# Altium schematic sheet CONNECTOR.SchDoc
size 420 x 297 mm; SheetNumber: 5; SheetTotal: 5
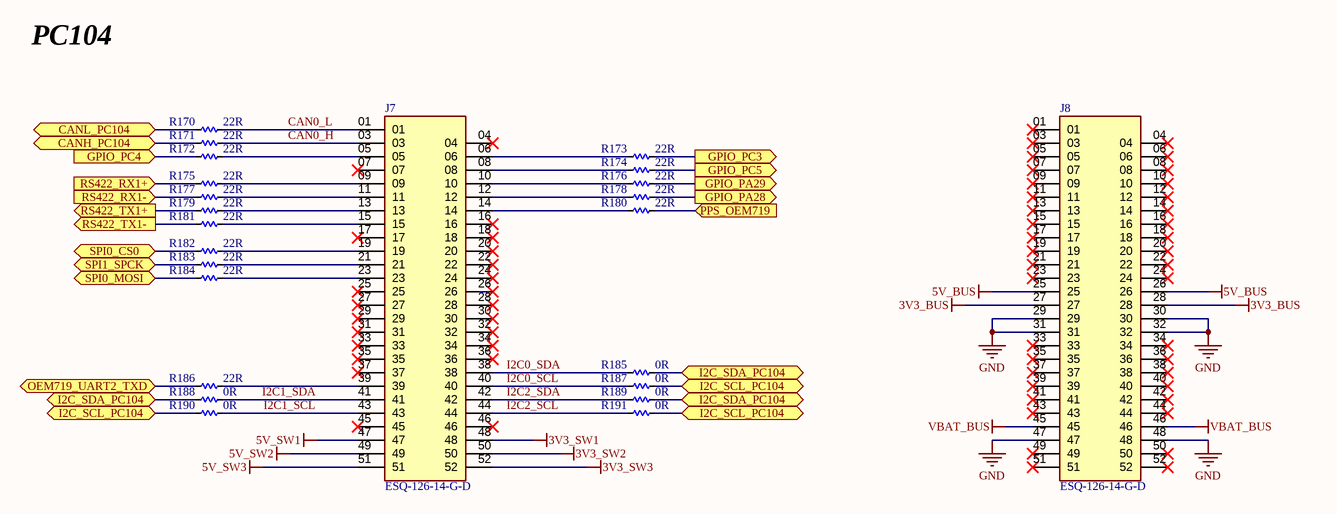
[diagram p0: CONNECTOR.SchDoc]

## Parts
J7  ESQ-126-14-G-D  [ESQ-126-14-G-D]
J8  ESQ-126-14-G-D  [ESQ-126-14-G-D]
R170  22R  [RES_C_1608X60]
R171  22R  [RES_C_1608X60]
R172  22R  [RES_C_1608X60]
R173  22R  [RES_C_1608X60]
R174  22R  [RES_C_1608X60]
R175  22R  [RES_C_1608X60]
R176  22R  [RES_C_1608X60]
R177  22R  [RES_C_1608X60]
R178  22R  [RES_C_1608X60]
R179  22R  [RES_C_1608X60]
R180  22R  [RES_C_1608X60]
R181  22R  [RES_C_1608X60]
R182  22R  [RES_C_1608X60]
R183  22R  [RES_C_1608X60]
R184  22R  [RES_C_1608X60]
R185  0R  [RES_C_1608X60]
R186  22R  [RES_C_1608X60]
R187  0R  [RES_C_1608X60]
R188  0R  [RES_C_1608X60]
R189  0R  [RES_C_1608X60]
R190  0R  [RES_C_1608X60]
R191  0R  [RES_C_1608X60]

## Ports
CANH_PC104 (bidir), CANL_PC104 (bidir), GPIO_PA28 (out), GPIO_PA29 (out), GPIO_PC3 (out), GPIO_PC4 (in), GPIO_PC5 (out), I2C_SCL_PC104 (bidir), I2C_SDA_PC104 (bidir), OEM719_UART2_TXD (bidir), PPS_OEM719 (in), RS422_RX1+ (in), RS422_RX1- (in), RS422_TX1+ (out), RS422_TX1- (out), SPI0_CS0 (bidir), SPI0_MOSI (bidir), SPI1_SPCK (bidir)

## Nets
3V3_BUS: J8.27 J8.28
3V3_SW1: J7.48
3V3_SW2: J7.50
3V3_SW3: J7.52
5V_BUS: J8.25 J8.26
5V_SW1: J7.47
5V_SW2: J7.49
5V_SW3: J7.51
GND: J8.29 J8.30 J8.31 J8.32 J8.47 J8.48
VBAT_BUS: J8.45 J8.46
CAN0_H: J7.03 R171.2
CAN0_L: J7.01 R170.2
CANH_PC104: R171.1 ; port CANH_PC104
CANL_PC104: R170.1 ; port CANL_PC104
GPIO_PA28: R178.2 ; port GPIO_PA28
GPIO_PA29: R176.2 ; port GPIO_PA29
GPIO_PC3: R173.2 ; port GPIO_PC3
GPIO_PC4: R172.1 ; port GPIO_PC4
GPIO_PC5: R174.2 ; port GPIO_PC5
I2C0_SCL: J7.40 R187.1
I2C0_SDA: J7.38 R185.1
I2C1_SCL: J7.43 R190.2
I2C1_SDA: J7.41 R188.2
I2C2_SCL: J7.44 R191.1
I2C2_SDA: J7.42 R189.1
I2C_SCL_PC104: R187.2 R190.1 R191.2 ; port I2C_SCL_PC104
I2C_SDA_PC104: R185.2 R188.1 R189.2 ; port I2C_SDA_PC104
OEM719_UART2_TXD: R186.1 ; port OEM719_UART2_TXD
PPS_OEM719: R180.2 ; port PPS_OEM719
RS422_RX1+: R175.1 ; port RS422_RX1+
RS422_RX1-: R177.1 ; port RS422_RX1-
RS422_TX1+: R179.1 ; port RS422_TX1+
RS422_TX1-: R181.1 ; port RS422_TX1-
SPI0_CS0: R182.1 ; port SPI0_CS0
SPI0_MOSI: R184.1 ; port SPI0_MOSI
SPI1_SPCK: R183.1 ; port SPI1_SPCK
NetJ7_05: J7.05 R172.2
NetJ7_06: J7.06 R173.1
NetJ7_08: J7.08 R174.1
NetJ7_09: J7.09 R175.2
NetJ7_10: J7.10 R176.1
NetJ7_11: J7.11 R177.2
NetJ7_12: J7.12 R178.1
NetJ7_13: J7.13 R179.2
NetJ7_14: J7.14 R180.1
NetJ7_15: J7.15 R181.2
NetJ7_19: J7.19 R182.2
NetJ7_21: J7.21 R183.2
NetJ7_23: J7.23 R184.2
NetJ7_39: J7.39 R186.2

Not connected (* = marked no-connect by the designer): J7 04* 07* 16* 17* 18* 20* 22* 24* 25* 26* 27* 28* 29* 30* 31* 32* 33* 34* 35* 36* 37* 45* 46*; J8 01* 03* 04* 05* 06* 07* 08* 09* 10* 11* 12* 13* 14* 15* 16* 17* 18* 19* 20* 21* 22* 23* 24* 33* 34* 35* 36* 37* 38* 39* 40* 41* 42* 43* 44* 49* 50* 51* 52*

## Notes on the sheet
- PC104
- Sub-system:
- Design by:
- Sheet title:
- Project:
- Sheet:
- of
- Checked by:
- Approved by:
- Doc no:
- Revision:
- Size:
- Date:

## Library data of the parts
J7 J8 = ESQ-126-14-G-D: PC / 104 Connectors Elevated Socket Strip
R170-R191 = _RES_B_2: RES